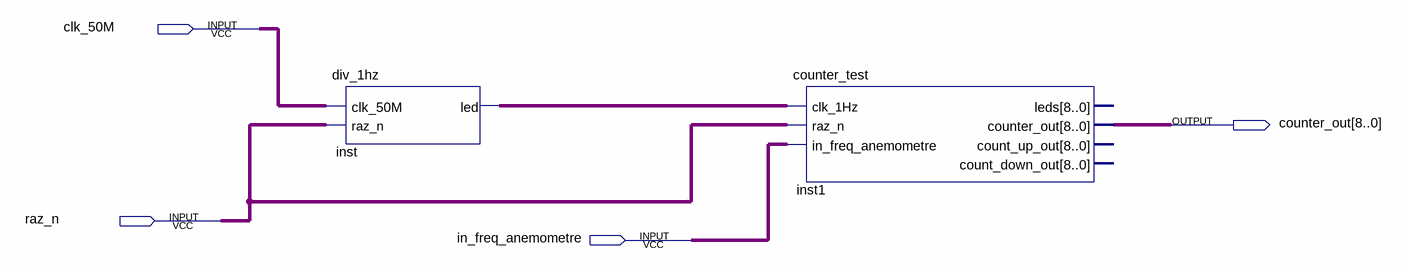
[diagram p0: schematic sheet]
// Quartus schematic bloc_div_compteur.bdf as structural Verilog: 2 symbols, 4 pins
module bloc_div_compteur (
  input  clk_50M,
  input  raz_n,
  input  in_freq_anemometre,
  output [8:0] counter_out
);

  wire inst_led;

  div_1hz inst (.clk_50M(clk_50M), .raz_n(raz_n), .led(inst_led));
  counter_test inst1 (
    .clk_1Hz(inst_led), .raz_n(raz_n), .in_freq_anemometre(in_freq_anemometre), .counter_out(counter_out));  // open: leds, count_up_out, count_down_out
endmodule
